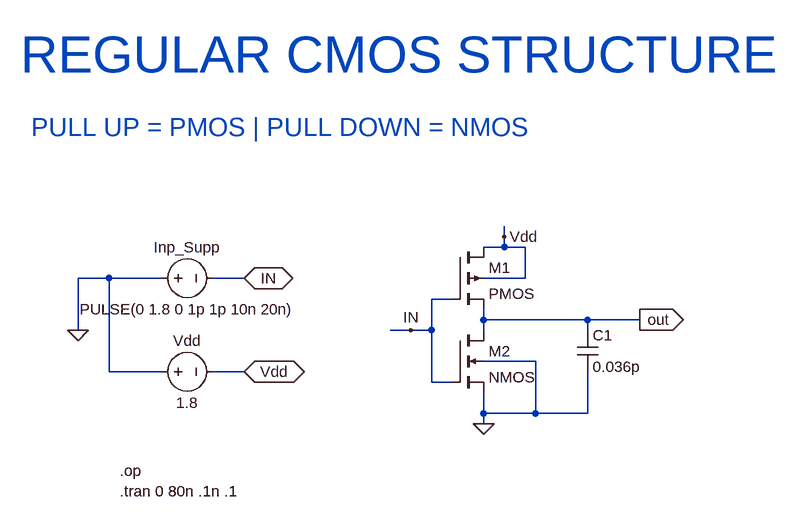
[diagram p0: schematic regular_cmos.asc]
regular_cmos.asc, the LTspice schematic file:
Version 4
SHEET 1 1144 680
WIRE 400 32 400 16
WIRE 400 48 400 32
WIRE 400 48 368 48
WIRE 432 48 400 48
WIRE -208 96 -256 96
WIRE -128 96 -208 96
WIRE 0 96 -48 96
WIRE 432 96 432 48
WIRE 432 96 368 96
WIRE 320 128 288 128
WIRE 368 160 368 144
WIRE 528 160 368 160
WIRE 608 160 528 160
WIRE -256 176 -256 96
WIRE 256 176 224 176
WIRE 288 176 288 128
WIRE 288 176 256 176
WIRE 368 176 368 160
WIRE 528 176 528 160
WIRE 448 224 368 224
WIRE -208 240 -208 96
WIRE -128 240 -208 240
WIRE 0 240 -48 240
WIRE 288 256 288 176
WIRE 320 256 288 256
WIRE 368 304 368 272
WIRE 448 304 448 224
WIRE 448 304 368 304
WIRE 528 304 528 240
WIRE 528 304 448 304
WIRE 368 320 368 304
FLAG 368 320 0
FLAG 608 160 out
IOPIN 608 160 Out
FLAG -256 176 0
FLAG 0 96 IN
IOPIN 0 96 BiDir
FLAG 0 240 Vdd
IOPIN 0 240 BiDir
FLAG 256 176 IN
FLAG 400 32 Vdd
SYMBOL pmos4 320 48 R0
SYMATTR InstName M1
SYMATTR Value2 l=180n w=2u
SYMBOL nmos4 320 176 R0
SYMATTR InstName M2
SYMATTR Value2 l=180n w=1u
SYMBOL cap 512 176 R0
SYMATTR InstName C1
SYMATTR Value 0.036p
SYMBOL voltage -144 96 R270
WINDOW 0 32 56 VTop 2
WINDOW 3 -32 56 VBottom 2
SYMATTR InstName Inp_Supp
SYMATTR Value PULSE(0 1.8 0 1p 1p 10n 20n)
SYMBOL voltage -144 240 R270
WINDOW 0 32 56 VTop 2
WINDOW 3 -32 56 VBottom 2
SYMATTR InstName Vdd
SYMATTR Value 1.8
TEXT -344 -248 Left 6 ;REGULAR CMOS STRUCTURE
TEXT -328 -136 Left 4 ;PULL UP = PMOS | PULL DOWN = NMOS
TEXT -192 392 Left 2 !.op
TEXT -192 424 Left 2 !.tran 0 80n .1n .1

The netlist it stands for:
* regular_cmos.asc
M1 Vdd IN out Vdd PMOS l=180n w=2u
M2 out IN 0 0 NMOS l=180n w=1u
C1 out 0 0.036p
V§Inp_Supp 0 IN PULSE(0 1.8 0 1p 1p 10n 20n)
Vdd 0 Vdd 1.8
.model NMOS NMOS
.model PMOS PMOS
.lib standard.mos
* REGULAR CMOS STRUCTURE
* PULL UP = PMOS | PULL DOWN = NMOS
.op
.tran 0 80n .1n .1
.backanno
.end